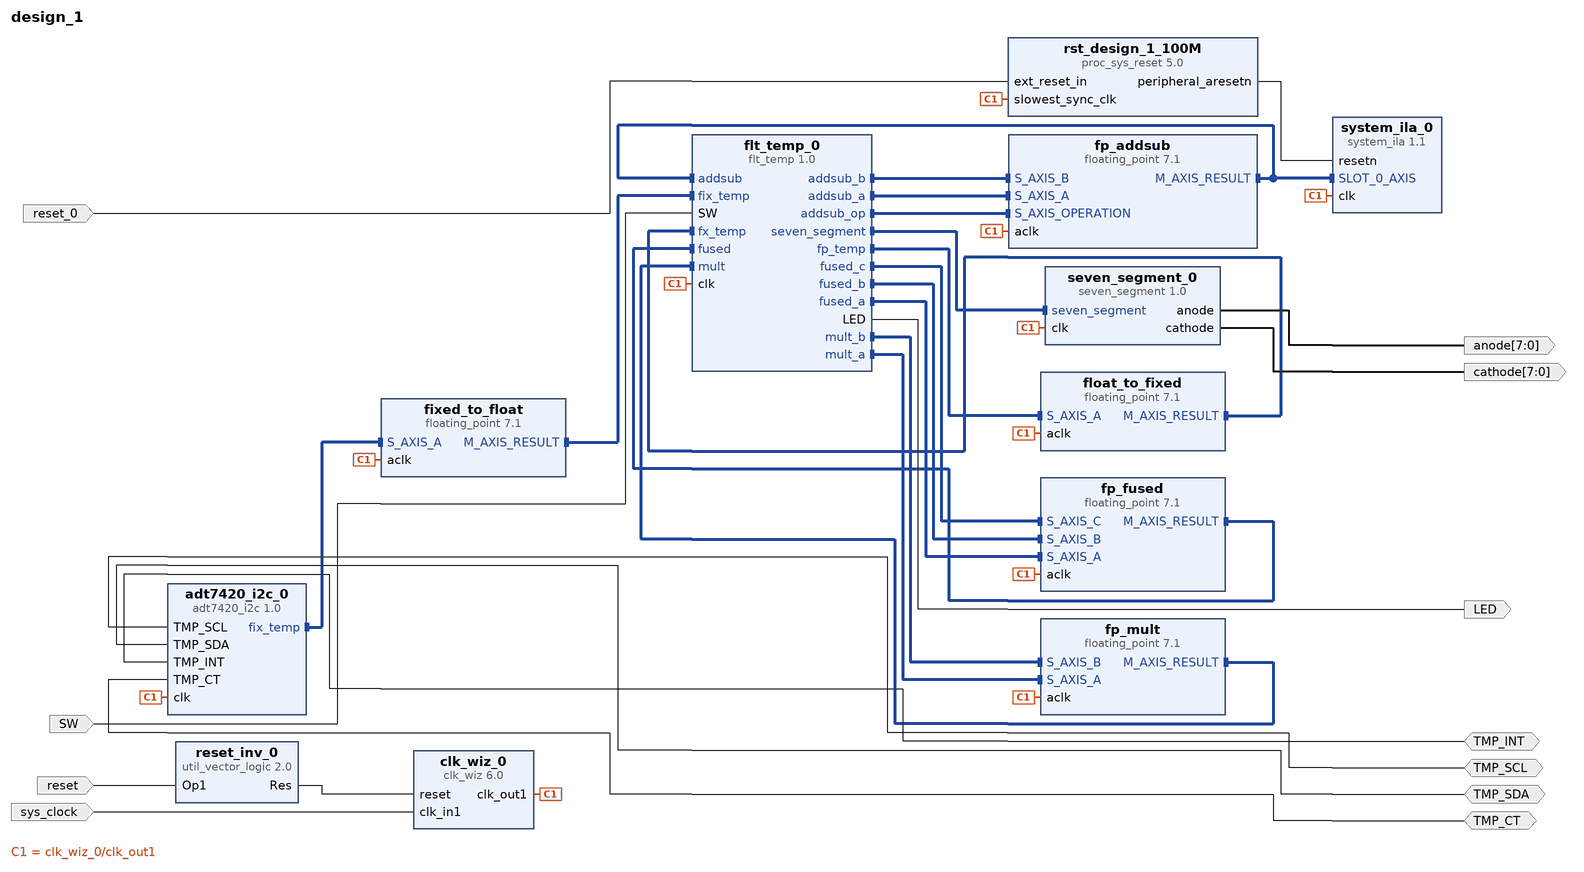
[diagram p0: block diagram of the top level]
# Vivado block design design_1, xc7a100tcsg324-1, Vivado 2020.1
create_bd_design design_1

create_bd_port -dir I -type clk sys_clock
set_property -dict {CONFIG.FREQ_HZ 100000000 CONFIG.PHASE 0.000} [get_bd_ports sys_clock]
create_bd_port -dir I -type rst reset
set_property -dict {CONFIG.POLARITY ACTIVE_LOW} [get_bd_ports reset]
create_bd_port -dir IO TMP_SCL
create_bd_port -dir IO TMP_SDA
create_bd_port -dir IO TMP_INT
create_bd_port -dir IO TMP_CT
create_bd_port -dir O -from 7 -to 0 anode
create_bd_port -dir O -from 7 -to 0 cathode
create_bd_port -dir I SW
create_bd_port -dir O LED
create_bd_port -dir I -type rst reset_0
set_property -dict {CONFIG.POLARITY ACTIVE_LOW} [get_bd_ports reset_0]

create_bd_cell -type ip -vlnv packtpub.com:user:adt7420_i2c:1.0 adt7420_i2c_0
create_bd_cell -type ip -vlnv user.org:user:seven_segment:1.0 seven_segment_0
create_bd_cell -type ip -vlnv user.org:user:flt_temp:1.0 flt_temp_0
create_bd_cell -type ip -vlnv xilinx.com:ip:clk_wiz:6.0 clk_wiz_0
set_property -dict [list \
  CONFIG.CLK_IN1_BOARD_INTERFACE sys_clock \
  CONFIG.RESET_BOARD_INTERFACE reset \
  CONFIG.USE_BOARD_FLOW true \
] [get_bd_cells clk_wiz_0]
create_bd_cell -type ip -vlnv xilinx.com:ip:floating_point:7.1 fixed_to_float
set_property -dict [list \
  CONFIG.A_Precision_Type Custom \
  CONFIG.C_A_Exponent_Width 12 \
  CONFIG.C_A_Fraction_Width 4 \
  CONFIG.C_Accum_Input_Msb 32 \
  CONFIG.C_Accum_Lsb -31 \
  CONFIG.C_Accum_Msb 32 \
  CONFIG.C_Latency 6 \
  CONFIG.C_Mult_Usage No_Usage \
  CONFIG.C_Rate 1 \
  CONFIG.C_Result_Exponent_Width 8 \
  CONFIG.C_Result_Fraction_Width 24 \
  CONFIG.Flow_Control NonBlocking \
  CONFIG.Has_RESULT_TREADY false \
  CONFIG.Operation_Type Fixed_to_float \
  CONFIG.Result_Precision_Type Single \
] [get_bd_cells fixed_to_float]
create_bd_cell -type ip -vlnv xilinx.com:ip:floating_point:7.1 float_to_fixed
set_property -dict [list \
  CONFIG.C_Latency 6 \
  CONFIG.C_Mult_Usage No_Usage \
  CONFIG.C_Rate 1 \
  CONFIG.C_Result_Exponent_Width 12 \
  CONFIG.C_Result_Fraction_Width 4 \
  CONFIG.Flow_Control NonBlocking \
  CONFIG.Has_RESULT_TREADY false \
  CONFIG.Operation_Type Float_to_fixed \
  CONFIG.Result_Precision_Type Custom \
] [get_bd_cells float_to_fixed]
create_bd_cell -type ip -vlnv xilinx.com:ip:floating_point:7.1 fp_addsub
set_property -dict {CONFIG.C_Latency 11 CONFIG.Flow_Control NonBlocking CONFIG.Has_RESULT_TREADY false} [get_bd_cells fp_addsub]
create_bd_cell -type ip -vlnv xilinx.com:ip:floating_point:7.1 fp_fused
set_property -dict [list \
  CONFIG.Add_Sub_Value Add \
  CONFIG.C_Latency 16 \
  CONFIG.C_Mult_Usage Medium_Usage \
  CONFIG.C_Rate 1 \
  CONFIG.C_Result_Exponent_Width 8 \
  CONFIG.C_Result_Fraction_Width 24 \
  CONFIG.Flow_Control NonBlocking \
  CONFIG.Has_RESULT_TREADY false \
  CONFIG.Operation_Type FMA \
  CONFIG.Result_Precision_Type Single \
] [get_bd_cells fp_fused]
create_bd_cell -type ip -vlnv xilinx.com:ip:floating_point:7.1 fp_mult
set_property -dict [list \
  CONFIG.Add_Sub_Value Both \
  CONFIG.C_Latency 6 \
  CONFIG.C_Mult_Usage Max_Usage \
  CONFIG.C_Rate 1 \
  CONFIG.C_Result_Exponent_Width 8 \
  CONFIG.C_Result_Fraction_Width 24 \
  CONFIG.Flow_Control NonBlocking \
  CONFIG.Has_RESULT_TREADY false \
  CONFIG.Operation_Type Multiply \
  CONFIG.Result_Precision_Type Single \
] [get_bd_cells fp_mult]
create_bd_cell -type ip -vlnv xilinx.com:ip:util_vector_logic:2.0 reset_inv_0
set_property -dict {CONFIG.C_OPERATION not CONFIG.C_SIZE 1} [get_bd_cells reset_inv_0]
create_bd_cell -type ip -vlnv xilinx.com:ip:system_ila:1.1 system_ila_0
set_property -dict [list \
  CONFIG.C_MON_TYPE INTERFACE \
  CONFIG.C_NUM_MONITOR_SLOTS 1 \
  CONFIG.C_SLOT_0_APC_EN 0 \
  CONFIG.C_SLOT_0_AXI_DATA_SEL 1 \
  CONFIG.C_SLOT_0_AXI_TRIG_SEL 1 \
  CONFIG.C_SLOT_0_INTF_TYPE xilinx.com:interface:axis_rtl:1.0 \
] [get_bd_cells system_ila_0]
create_bd_cell -type ip -vlnv xilinx.com:ip:proc_sys_reset:5.0 rst_design_1_100M
set_property -dict {CONFIG.RESET_BOARD_INTERFACE reset CONFIG.USE_BOARD_FLOW true} [get_bd_cells rst_design_1_100M]

# ---- connections ----

connect_bd_intf_net [get_bd_intf_pins flt_temp_0/seven_segment] [get_bd_intf_pins seven_segment_0/seven_segment]
connect_bd_intf_net [get_bd_intf_pins fp_fused/S_AXIS_C] [get_bd_intf_pins flt_temp_0/fused_c]
connect_bd_intf_net [get_bd_intf_pins fp_fused/S_AXIS_B] [get_bd_intf_pins flt_temp_0/fused_b]
connect_bd_intf_net [get_bd_intf_pins fp_fused/S_AXIS_A] [get_bd_intf_pins flt_temp_0/fused_a]
connect_bd_intf_net [get_bd_intf_pins fp_fused/M_AXIS_RESULT] [get_bd_intf_pins flt_temp_0/fused]
connect_bd_intf_net [get_bd_intf_pins fp_addsub/S_AXIS_B] [get_bd_intf_pins flt_temp_0/addsub_b]
connect_bd_intf_net [get_bd_intf_pins fp_addsub/S_AXIS_A] [get_bd_intf_pins flt_temp_0/addsub_a]
connect_bd_intf_net [get_bd_intf_pins fp_addsub/S_AXIS_OPERATION] [get_bd_intf_pins flt_temp_0/addsub_op]
connect_bd_intf_net [get_bd_intf_pins adt7420_i2c_0/fix_temp] [get_bd_intf_pins fixed_to_float/S_AXIS_A]
connect_bd_intf_net [get_bd_intf_pins flt_temp_0/mult_b] [get_bd_intf_pins fp_mult/S_AXIS_B]
connect_bd_intf_net [get_bd_intf_pins fixed_to_float/M_AXIS_RESULT] [get_bd_intf_pins flt_temp_0/fix_temp]
connect_bd_intf_net [get_bd_intf_pins flt_temp_0/mult] [get_bd_intf_pins fp_mult/M_AXIS_RESULT]
connect_bd_intf_net -intf_net fp_addsub_M_AXIS_RESULT [get_bd_intf_pins fp_addsub/M_AXIS_RESULT] [get_bd_intf_pins flt_temp_0/addsub]
connect_bd_intf_net [get_bd_intf_pins fp_addsub/M_AXIS_RESULT] [get_bd_intf_pins system_ila_0/SLOT_0_AXIS]
connect_bd_intf_net [get_bd_intf_pins flt_temp_0/mult_a] [get_bd_intf_pins fp_mult/S_AXIS_A]
connect_bd_intf_net [get_bd_intf_pins float_to_fixed/S_AXIS_A] [get_bd_intf_pins flt_temp_0/fp_temp]
connect_bd_intf_net [get_bd_intf_pins float_to_fixed/M_AXIS_RESULT] [get_bd_intf_pins flt_temp_0/fx_temp]
connect_bd_net [get_bd_ports sys_clock] [get_bd_pins clk_wiz_0/clk_in1]
connect_bd_net [get_bd_pins clk_wiz_0/clk_out1] \
  [get_bd_pins adt7420_i2c_0/clk] [get_bd_pins fixed_to_float/aclk] [get_bd_pins float_to_fixed/aclk] \
  [get_bd_pins flt_temp_0/clk] [get_bd_pins fp_addsub/aclk] [get_bd_pins fp_fused/aclk] [get_bd_pins fp_mult/aclk] \
  [get_bd_pins seven_segment_0/clk] [get_bd_pins system_ila_0/clk] [get_bd_pins rst_design_1_100M/slowest_sync_clk]
connect_bd_net [get_bd_ports reset] [get_bd_pins reset_inv_0/Op1]
connect_bd_net [get_bd_pins reset_inv_0/Res] [get_bd_pins clk_wiz_0/reset]
connect_bd_net [get_bd_ports TMP_SCL] [get_bd_pins adt7420_i2c_0/TMP_SCL]
connect_bd_net [get_bd_ports TMP_SDA] [get_bd_pins adt7420_i2c_0/TMP_SDA]
connect_bd_net [get_bd_ports TMP_INT] [get_bd_pins adt7420_i2c_0/TMP_INT]
connect_bd_net [get_bd_ports TMP_CT] [get_bd_pins adt7420_i2c_0/TMP_CT]
connect_bd_net [get_bd_pins seven_segment_0/anode] [get_bd_ports anode]
connect_bd_net [get_bd_pins seven_segment_0/cathode] [get_bd_ports cathode]
connect_bd_net -net SW_0_1 [get_bd_ports SW] [get_bd_pins flt_temp_0/SW]
connect_bd_net [get_bd_pins flt_temp_0/LED] [get_bd_ports LED]
connect_bd_net [get_bd_pins rst_design_1_100M/peripheral_aresetn] [get_bd_pins system_ila_0/resetn]
connect_bd_net -net reset_0_1 [get_bd_ports reset_0] [get_bd_pins rst_design_1_100M/ext_reset_in]
set_property HDL_ATTRIBUTE.DEBUG true [get_bd_intf_nets fp_addsub_M_AXIS_RESULT]
set_property HDL_ATTRIBUTE.MARK_DEBUG true [get_bd_intf_nets fp_addsub_M_AXIS_RESULT]

validate_bd_design
save_bd_design
